# EAGLE design Arctos 65 V0 (EAGLE 9.6.2)
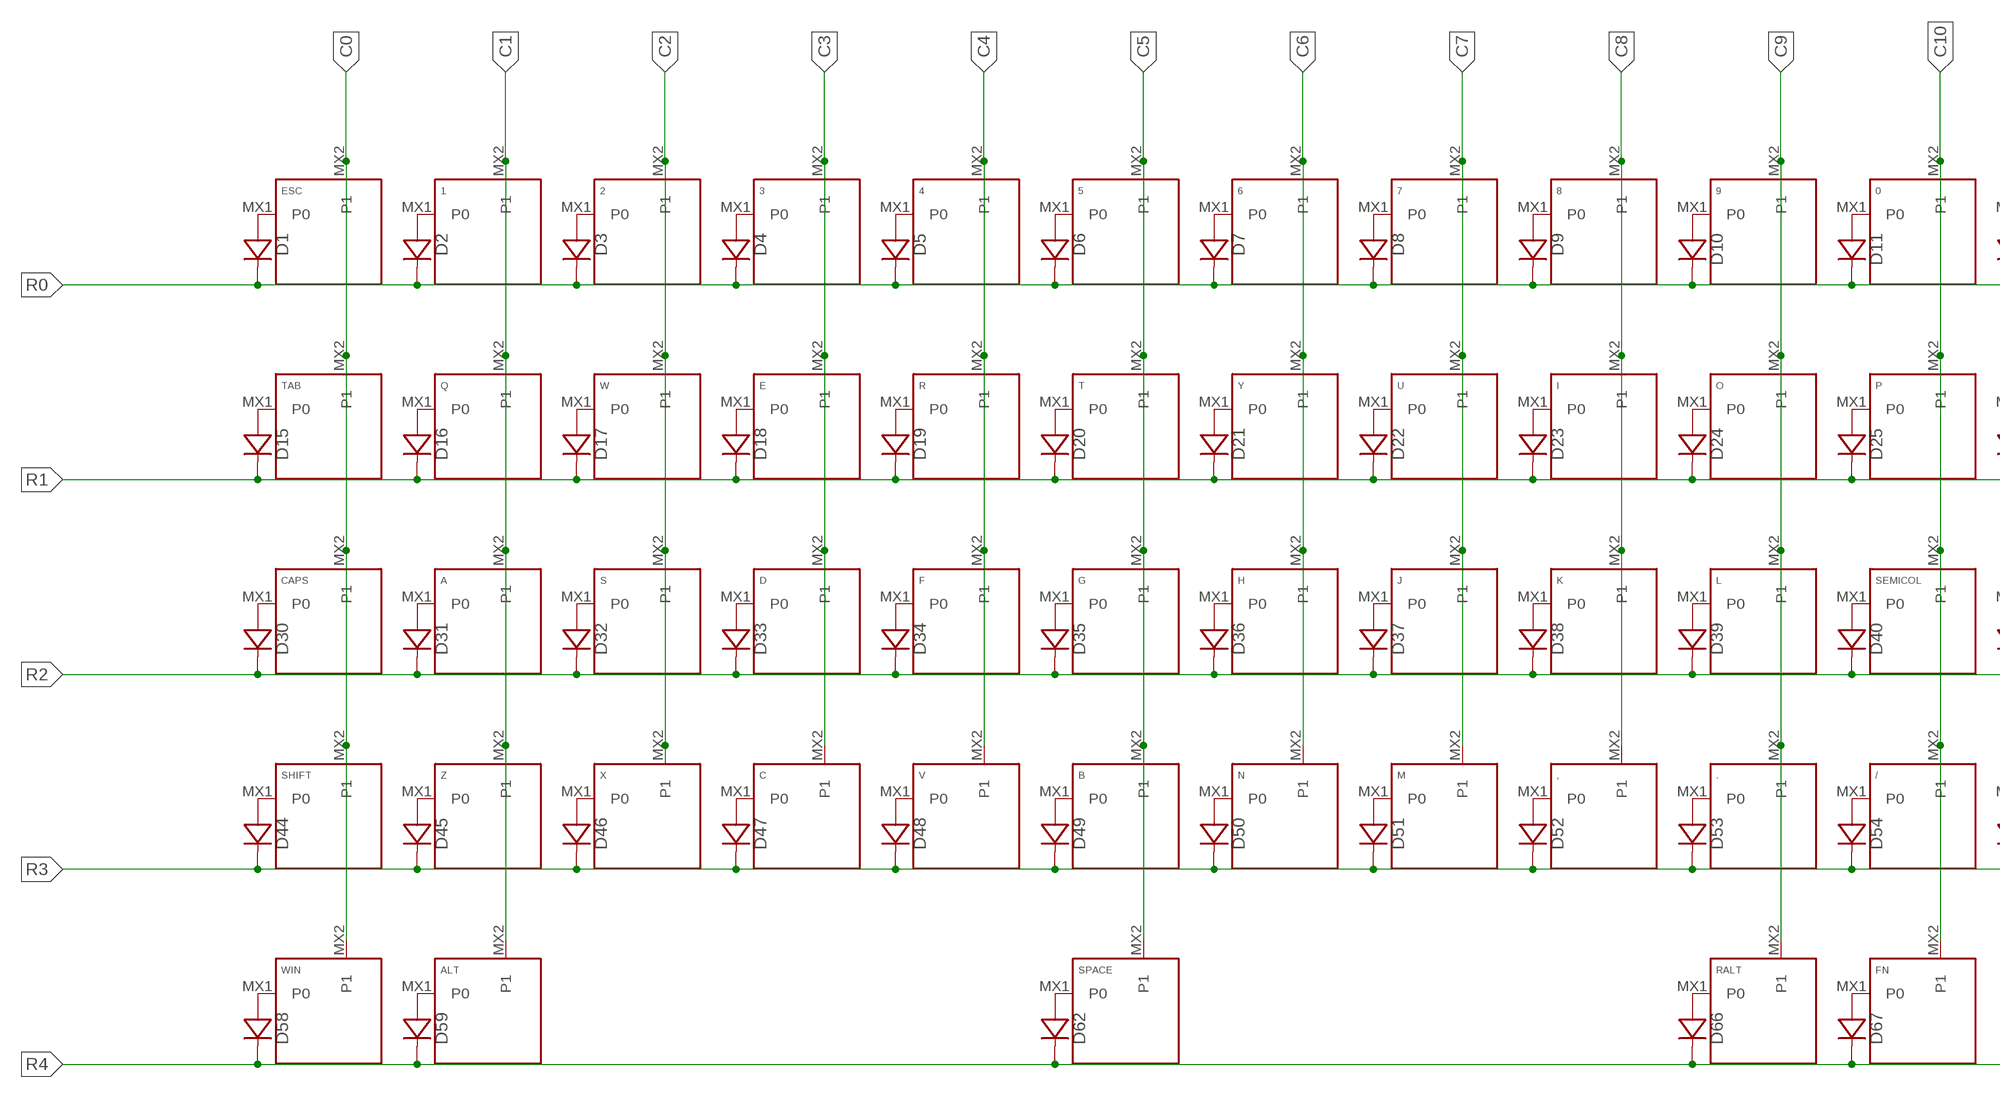
[diagram p0: schematic, sheet 1, part 1 of 2]
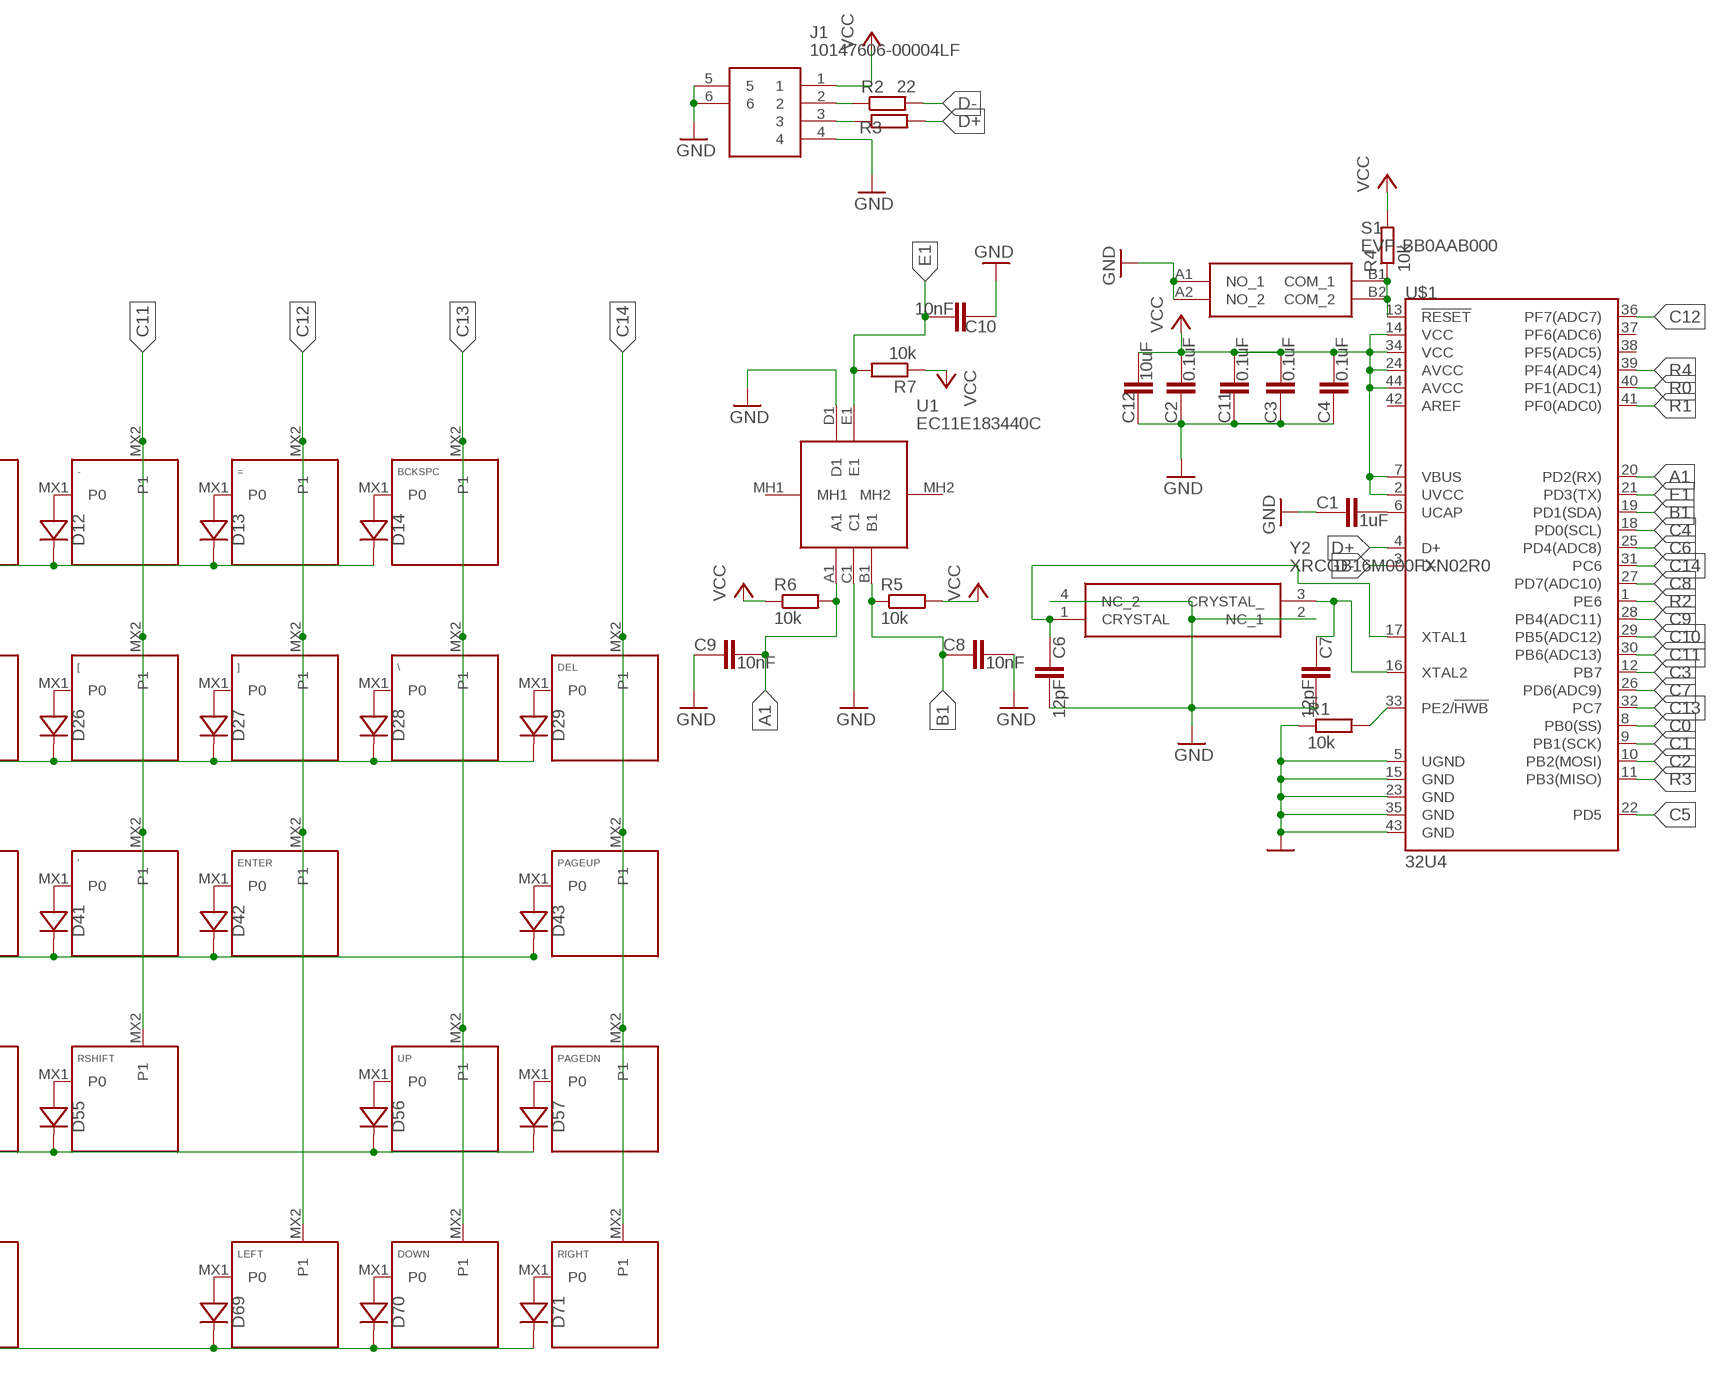
[diagram p1: schematic, sheet 1, part 2 of 2]

## Parts
0  KEYSWITCH-PLAIN-MXHSPCB-1U  [MXHSPCB-1U]
1  KEYSWITCH-PLAIN-MXHSPCB-1U  [MXHSPCB-1U]
2  KEYSWITCH-PLAIN-MXHSPCB-1U  [MXHSPCB-1U]
3  KEYSWITCH-PLAIN-MXHSPCB-1U  [MXHSPCB-1U]
4  KEYSWITCH-PLAIN-MXHSPCB-1U  [MXHSPCB-1U]
5  KEYSWITCH-PLAIN-MXHSPCB-1U  [MXHSPCB-1U]
6  KEYSWITCH-PLAIN-MXHSPCB-1U  [MXHSPCB-1U]
7  KEYSWITCH-PLAIN-MXHSPCB-1U  [MXHSPCB-1U]
8  KEYSWITCH-PLAIN-MXHSPCB-1U  [MXHSPCB-1U]
9  KEYSWITCH-PLAIN-MXHSPCB-1U  [MXHSPCB-1U]
'  KEYSWITCH-PLAIN-MXHSPCB-1U  [MXHSPCB-1U]
,  KEYSWITCH-PLAIN-MXHSPCB-1U  [MXHSPCB-1U]
-  KEYSWITCH-PLAIN-MXHSPCB-1U  [MXHSPCB-1U]
.  KEYSWITCH-PLAIN-MXHSPCB-1U  [MXHSPCB-1U]
/  KEYSWITCH-PLAIN-MXHSPCB-1U  [MXHSPCB-1U]
=  KEYSWITCH-PLAIN-MXHSPCB-1U  [MXHSPCB-1U]
[  KEYSWITCH-PLAIN-MXHSPCB-1U  [MXHSPCB-1U]
\  KEYSWITCH-PLAIN-MXHSPCB-1U  [MXHSPCB-1U]
]  KEYSWITCH-PLAIN-MXHSPCB-1U  [MXHSPCB-1U]
A  KEYSWITCH-PLAIN-MXHSPCB-1U  [MXHSPCB-1U]
ALT  KEYSWITCH-PLAIN-MXHSPCB-1U  [MXHSPCB-1U]
B  KEYSWITCH-PLAIN-MXHSPCB-1U  [MXHSPCB-1U]
BCKSPC  KEYSWITCH-PLAIN-MXHSPCB-2U  [MXHSPCB-2U]
C  KEYSWITCH-PLAIN-MXHSPCB-1U  [MXHSPCB-1U]
C1  1uF  CAPACITOR-0603  [C0603]
C2  0.1uF  CAPACITOR-0603  [C0603]
C3  0.1uF  CAPACITOR-0603  [C0603]
C4  0.1uF  CAPACITOR-0603  [C0603]
C6  12pF  CAPACITOR-0603  [C0603]
C7  12pF  CAPACITOR-0603  [C0603]
C8  10nF  CAPACITOR-0603  [C0603]
C9  10nF  CAPACITOR-0603  [C0603]
C10  10nF  CAPACITOR-0603  [C0603]
C11  0.1uF  CAPACITOR-0603  [C0603]
C12  10uF  CAPACITOR-0603  [C0603]
CAPS  KEYSWITCH-PLAIN-MXHSPCB-1U  [MXHSPCB-1U]
D  KEYSWITCH-PLAIN-MXHSPCB-1U  [MXHSPCB-1U]
D1  DIODE-SOD-123  [SOD-123]
D2  DIODE-SOD-123  [SOD-123]
D3  DIODE-SOD-123  [SOD-123]
D4  DIODE-SOD-123  [SOD-123]
D5  DIODE-SOD-123  [SOD-123]
D6  DIODE-SOD-123  [SOD-123]
D7  DIODE-SOD-123  [SOD-123]
D8  DIODE-SOD-123  [SOD-123]
D9  DIODE-SOD-123  [SOD-123]
D10  DIODE-SOD-123  [SOD-123]
D11  DIODE-SOD-123  [SOD-123]
D12  DIODE-SOD-123  [SOD-123]
D13  DIODE-SOD-123  [SOD-123]
D14  DIODE-SOD-123  [SOD-123]
D15  DIODE-SOD-123  [SOD-123]
D16  DIODE-SOD-123  [SOD-123]
D17  DIODE-SOD-123  [SOD-123]
D18  DIODE-SOD-123  [SOD-123]
D19  DIODE-SOD-123  [SOD-123]
D20  DIODE-SOD-123  [SOD-123]
D21  DIODE-SOD-123  [SOD-123]
D22  DIODE-SOD-123  [SOD-123]
D23  DIODE-SOD-123  [SOD-123]
D24  DIODE-SOD-123  [SOD-123]
D25  DIODE-SOD-123  [SOD-123]
D26  DIODE-SOD-123  [SOD-123]
D27  DIODE-SOD-123  [SOD-123]
D28  DIODE-SOD-123  [SOD-123]
D29  DIODE-SOD-123  [SOD-123]
D30  DIODE-SOD-123  [SOD-123]
D31  DIODE-SOD-123  [SOD-123]
D32  DIODE-SOD-123  [SOD-123]
D33  DIODE-SOD-123  [SOD-123]
D34  DIODE-SOD-123  [SOD-123]
D35  DIODE-SOD-123  [SOD-123]
D36  DIODE-SOD-123  [SOD-123]
D37  DIODE-SOD-123  [SOD-123]
D38  DIODE-SOD-123  [SOD-123]
D39  DIODE-SOD-123  [SOD-123]
D40  DIODE-SOD-123  [SOD-123]
D41  DIODE-SOD-123  [SOD-123]
D42  DIODE-SOD-123  [SOD-123]
D43  DIODE-SOD-123  [SOD-123]
D44  DIODE-SOD-123  [SOD-123]
D45  DIODE-SOD-123  [SOD-123]
D46  DIODE-SOD-123  [SOD-123]
D47  DIODE-SOD-123  [SOD-123]
D48  DIODE-SOD-123  [SOD-123]
D49  DIODE-SOD-123  [SOD-123]
D50  DIODE-SOD-123  [SOD-123]
D51  DIODE-SOD-123  [SOD-123]
D52  DIODE-SOD-123  [SOD-123]
D53  DIODE-SOD-123  [SOD-123]
D54  DIODE-SOD-123  [SOD-123]
D55  DIODE-SOD-123  [SOD-123]
D56  DIODE-SOD-123  [SOD-123]
D57  DIODE-SOD-123  [SOD-123]
D58  DIODE-SOD-123  [SOD-123]
D59  DIODE-SOD-123  [SOD-123]
D62  DIODE-SOD-123  [SOD-123]
D66  DIODE-SOD-123  [SOD-123]
D67  DIODE-SOD-123  [SOD-123]
D69  DIODE-SOD-123  [SOD-123]
D70  DIODE-SOD-123  [SOD-123]
D71  DIODE-SOD-123  [SOD-123]
DEL  KEYSWITCH-PLAIN-MXHSPCB-1U  [MXHSPCB-1U]
DOWN  KEYSWITCH-PLAIN-MXHSPCB-1U  [MXHSPCB-1U]
E  KEYSWITCH-PLAIN-MXHSPCB-1U  [MXHSPCB-1U]
ENTER  KEYSWITCH-PLAIN-MXHSPCB-2U  [MXHSPCB-2U]
ESC  KEYSWITCH-PLAIN-MXHSPCB-1U  [MXHSPCB-1U]
F  KEYSWITCH-PLAIN-MXHSPCB-1U  [MXHSPCB-1U]
FN  KEYSWITCH-PLAIN-MXHSPCB-1U  [MXHSPCB-1U]
G  KEYSWITCH-PLAIN-MXHSPCB-1U  [MXHSPCB-1U]
H  KEYSWITCH-PLAIN-MXHSPCB-1U  [MXHSPCB-1U]
I  KEYSWITCH-PLAIN-MXHSPCB-1U  [MXHSPCB-1U]
J  KEYSWITCH-PLAIN-MXHSPCB-1U  [MXHSPCB-1U]
J1  10147606-00004LF  [1014760600004LF]
K  KEYSWITCH-PLAIN-MXHSPCB-1U  [MXHSPCB-1U]
L  KEYSWITCH-PLAIN-MXHSPCB-1U  [MXHSPCB-1U]
LEFT  KEYSWITCH-PLAIN-MXHSPCB-1U  [MXHSPCB-1U]
M  KEYSWITCH-PLAIN-MXHSPCB-1U  [MXHSPCB-1U]
N  KEYSWITCH-PLAIN-MXHSPCB-1U  [MXHSPCB-1U]
O  KEYSWITCH-PLAIN-MXHSPCB-1U  [MXHSPCB-1U]
P  KEYSWITCH-PLAIN-MXHSPCB-1U  [MXHSPCB-1U]
PAGEDN  KEYSWITCH-PLAIN-MXHSPCB-1U  [MXHSPCB-1U]
PAGEUP  KEYSWITCH-PLAIN-MXHSPCB-1U  [MXHSPCB-1U]
Q  KEYSWITCH-PLAIN-MXHSPCB-1U  [MXHSPCB-1U]
R  KEYSWITCH-PLAIN-MXHSPCB-1U  [MXHSPCB-1U]
R1  10k  RESISTOR-0603  [R0603]
R2  22  RESISTOR-0603  [R0603]
R3  22  RESISTOR-0603  [R0603]
R4  10k  RESISTOR-0603  [R0603]
R5  10k  RESISTOR-0603  [R0603]
R6  10k  RESISTOR-0603  [R0603]
R7  10k  RESISTOR-0603  [R0603]
RALT  KEYSWITCH-PLAIN-MXHSPCB-1U  [MXHSPCB-1U]
RIGHT  KEYSWITCH-PLAIN-MXHSPCB-1U  [MXHSPCB-1U]
RSHIFT  KEYSWITCH-PLAIN-MXHSPCB-1U  [MXHSPCB-1U]
S  KEYSWITCH-PLAIN-MXHSPCB-1U  [MXHSPCB-1U]
S1  EVP-BB0AAB000  [EVPBB0AAB000]
SEMICOL  KEYSWITCH-PLAIN-MXHSPCB-1U  [MXHSPCB-1U]
SHIFT  KEYSWITCH-PLAIN-MXHSPCB-2U  [MXHSPCB-2U]
SPACE  KEYSWITCH-PLAIN-MXHSPCB-7U-FLIPPED  [MXHSPCB-7U-FLIPPED]
T  KEYSWITCH-PLAIN-MXHSPCB-1U  [MXHSPCB-1U]
TAB  KEYSWITCH-PLAIN-MXHSPCB-1U  [MXHSPCB-1U]
U  KEYSWITCH-PLAIN-MXHSPCB-1U  [MXHSPCB-1U]
U1  EC11E183440C  [EC11E183440C]
U$1  32U4  ATMEGA32U4TQFP-44  [TQFP44]
UP  KEYSWITCH-PLAIN-MXHSPCB-1U  [MXHSPCB-1U]
V  KEYSWITCH-PLAIN-MXHSPCB-1U  [MXHSPCB-1U]
W  KEYSWITCH-PLAIN-MXHSPCB-1U  [MXHSPCB-1U]
WIN  KEYSWITCH-PLAIN-MXHSPCB-1U  [MXHSPCB-1U]
X  KEYSWITCH-PLAIN-MXHSPCB-1U  [MXHSPCB-1U]
Y  KEYSWITCH-PLAIN-MXHSPCB-1U  [MXHSPCB-1U]
Y2  XRCGB16M000FXN02R0  [XRCGB16M000FXN02R0]
Z  KEYSWITCH-PLAIN-MXHSPCB-1U  [MXHSPCB-1U]

## Nets
A1: C9.2 R6.2 U1.A1 U$1.20(PD2(RX))
B1: C8.1 R5.1 U1.B1 U$1.19(PD1(SDA))
C0: CAPS.MX2(P1) ESC.MX2(P1) SHIFT.MX2(P1) TAB.MX2(P1) U$1.8(PB0(SS)) WIN.MX2(P1)
C1: 1.MX2(P1) A.MX2(P1) ALT.MX2(P1) Q.MX2(P1) U$1.9(PB1(SCK)) Z.MX2(P1)
C2: 2.MX2(P1) S.MX2(P1) U$1.10(PB2(MOSI)) W.MX2(P1) X.MX2(P1)
C3: 3.MX2(P1) C.MX2(P1) D.MX2(P1) E.MX2(P1) U$1.12(PB7)
C4: 4.MX2(P1) F.MX2(P1) R.MX2(P1) U$1.18(PD0(SCL)) V.MX2(P1)
C5: 5.MX2(P1) B.MX2(P1) G.MX2(P1) SPACE.MX2(P1) T.MX2(P1) U$1.22(PD5)
C6: 6.MX2(P1) H.MX2(P1) N.MX2(P1) U$1.25(PD4(ADC8)) Y.MX2(P1)
C7: 7.MX2(P1) J.MX2(P1) M.MX2(P1) U$1.26(PD6(ADC9)) U.MX2(P1)
C8: 8.MX2(P1) ,.MX2(P1) I.MX2(P1) K.MX2(P1) U$1.27(PD7(ADC10))
C9: 9.MX2(P1) ..MX2(P1) L.MX2(P1) O.MX2(P1) RALT.MX2(P1) U$1.28(PB4(ADC11))
C10: 0.MX2(P1) /.MX2(P1) FN.MX2(P1) P.MX2(P1) SEMICOL.MX2(P1) U$1.29(PB5(ADC12))
C11: '.MX2(P1) -.MX2(P1) [.MX2(P1) RSHIFT.MX2(P1) U$1.30(PB6(ADC13))
C12: =.MX2(P1) ].MX2(P1) ENTER.MX2(P1) LEFT.MX2(P1) U$1.36(PF7(ADC7))
C13: \.MX2(P1) BCKSPC.MX2(P1) DOWN.MX2(P1) U$1.32(PC7) UP.MX2(P1)
C14: DEL.MX2(P1) PAGEDN.MX2(P1) PAGEUP.MX2(P1) RIGHT.MX2(P1) U$1.31(PC6)
D+: R3.2 U$1.4(D+)
D-: R2.2 U$1.3(D-)
E1: C10.2 R7.2 U1.E1 U$1.21(PD3(TX))
GND: C1.1 C2.1 C3.1 C4.1 C6.2 C7.2 C8.2 C9.1 C10.1 C11.1 C12.1 J1.4 J1.5 J1.6 R1.1 S1.A1(NO_1) S1.A2(NO_2) U1.C1 U1.D1 U$1.5(UGND) U$1.15(GND) U$1.23(GND) U$1.35(GND) U$1.43(GND) Y2.2(NC_1) Y2.4(NC_2)
N$1: 4.MX1(P0) D5.A
N$2: 5.MX1(P0) D6.A
N$3: 6.MX1(P0) D7.A
N$4: 7.MX1(P0) D8.A
N$5: 8.MX1(P0) D9.A
N$6: 9.MX1(P0) D10.A
N$7: 0.MX1(P0) D11.A
N$8: -.MX1(P0) D12.A
N$9: =.MX1(P0) D13.A
N$10: BCKSPC.MX1(P0) D14.A
N$11: D15.A TAB.MX1(P0)
N$12: D16.A Q.MX1(P0)
N$13: D17.A W.MX1(P0)
N$14: D18.A E.MX1(P0)
N$15: D19.A R.MX1(P0)
N$16: D20.A T.MX1(P0)
N$17: D21.A Y.MX1(P0)
N$18: D22.A U.MX1(P0)
N$19: D23.A I.MX1(P0)
N$20: D24.A O.MX1(P0)
N$21: D25.A P.MX1(P0)
N$22: [.MX1(P0) D26.A
N$23: ].MX1(P0) D27.A
N$24: \.MX1(P0) D28.A
N$25: D29.A DEL.MX1(P0)
N$26: CAPS.MX1(P0) D30.A
N$27: A.MX1(P0) D31.A
N$28: D32.A S.MX1(P0)
N$29: D33.A D.MX1(P0)
N$30: D34.A F.MX1(P0)
N$31: D35.A G.MX1(P0)
N$32: D36.A H.MX1(P0)
N$33: D37.A J.MX1(P0)
N$34: D38.A K.MX1(P0)
N$35: D39.A L.MX1(P0)
N$36: D40.A SEMICOL.MX1(P0)
N$37: '.MX1(P0) D41.A
N$38: D42.A ENTER.MX1(P0)
N$39: D43.A PAGEUP.MX1(P0)
N$40: D45.A Z.MX1(P0)
N$41: D46.A X.MX1(P0)
N$42: C.MX1(P0) D47.A
N$43: D48.A V.MX1(P0)
N$44: D1.A ESC.MX1(P0)
N$45: B.MX1(P0) D49.A
N$46: D50.A N.MX1(P0)
N$47: 1.MX1(P0) D2.A
N$48: D51.A M.MX1(P0)
N$49: ,.MX1(P0) D52.A
N$50: ..MX1(P0) D53.A
N$51: /.MX1(P0) D54.A
N$52: D55.A RSHIFT.MX1(P0)
N$53: 2.MX1(P0) D3.A
N$54: 3.MX1(P0) D4.A
N$55: D56.A UP.MX1(P0)
N$56: D44.A SHIFT.MX1(P0)
N$57: D57.A PAGEDN.MX1(P0)
N$58: D58.A WIN.MX1(P0)
N$59: ALT.MX1(P0) D59.A
N$60: D66.A RALT.MX1(P0)
N$61: D67.A FN.MX1(P0)
N$62: D69.A LEFT.MX1(P0)
N$63: D70.A DOWN.MX1(P0)
N$64: D71.A RIGHT.MX1(P0)
N$65: D62.A SPACE.MX1(P0)
N$66: R4.1 S1.B1(COM_1) S1.B2(COM_2) U$1.13(!RESET)
N$67: R1.2 U$1.33(PE2/!HWB)
N$68: J1.2 R2.1
N$69: J1.3 R3.1
N$70: C1.2 U$1.6(UCAP)
N$71: C6.1 U$1.17(XTAL1) Y2.1(CRYSTAL)
N$73: C7.1 U$1.16(XTAL2) Y2.3(CRYSTAL_)
R0: D1.C D2.C D3.C D4.C D5.C D6.C D7.C D8.C D9.C D10.C D11.C D12.C D13.C D14.C U$1.40(PF1(ADC1))
R1: D15.C D16.C D17.C D18.C D19.C D20.C D21.C D22.C D23.C D24.C D25.C D26.C D27.C D28.C D29.C U$1.41(PF0(ADC0))
R2: D30.C D31.C D32.C D33.C D34.C D35.C D36.C D37.C D38.C D39.C D40.C D41.C D42.C D43.C U$1.1(PE6)
R3: D44.C D45.C D46.C D47.C D48.C D49.C D50.C D51.C D52.C D53.C D54.C D55.C D56.C D57.C U$1.11(PB3(MISO))
R4: D58.C D59.C D62.C D66.C D67.C D69.C D70.C D71.C U$1.39(PF4(ADC4))
VCC: C2.2 C3.2 C4.2 C11.2 C12.2 J1.1 R4.2 R5.2 R6.1 R7.1 U$1.2(UVCC) U$1.7(VBUS) U$1.14(VCC) U$1.24(AVCC) U$1.34(VCC) U$1.44(AVCC)
Unconnected: U1.MH1 U1.MH2 U$1.37(PF6(ADC6)) U$1.38(PF5(ADC5)) U$1.42(AREF)

## Library data of the parts
0 1-9 ' , - . / = [ \ ] A ALT B BCKSPC C CAPS D DEL DOWN E ENTER ESC F FN G H I J K L LEFT M N O P PAGEDN PAGEUP Q R RALT RIGHT RSHIFT S SEMICOL SHIFT SPACE T TAB U UP V W WIN X Y Z = Keyboard:KEYSWITCH-PLAIN
C1-C4 C6-C12 = Components:CAPACITOR
D1-D59 D62 D66 D67 D69-D71 = Components:DIODE: Standard 1N4148 diode
J1 = SamacSys_Parts:10147606-00004LF: Headers & Wire Housings R/A SMT Header Source: Datasheet <https://cdn.amphenol-icc.com/media/wysiwyg/files/drawing/10147606.pdf>; DESCRIPTION: Headers & Wire Housings R/A SMT Header; HEIGHT: 3.1mm; MANUFACTURER_NAME: Amphenol; MANUFACTURER_PART_NUMBER: 10147606-00004LF; MOUSER_PART_NUMBER: 649-10147606-00004LF; MOUSER_PRICE-STOCK: https://www.mouser.co.uk/ProductDetail/Amphenol-FCI/10147606-00004LF?qs=w%2Fv1CP2dgqrztttIAfWk1w%3D%3D
R1-R7 = Components:RESISTOR
S1 = SamacSys_Parts:EVP-BB0AAB000: Tactile Switches 2.6x1.6x0.5mm 0.7N 0.08mm Travel Source: Datasheet <https://componentsearchengine.com/Datasheets/1/EVP-BB0AAB000.pdf>; DESCRIPTION: Tactile Switches 2.6x1.6x0.5mm 0.7N 0.08mm Travel; HEIGHT: 0.6mm; MANUFACTURER_NAME: Panasonic; MANUFACTURER_PART_NUMBER: EVP-BB0AAB000; MOUSER_PART_NUMBER: 667-EVP-BB0AAB000; MOUSER_PRICE-STOCK: https://www.mouser.co.uk/ProductDetail/Panasonic/EVP-BB0AAB000?qs=PzGy0jfpSMt797eGA9Hkvg%3D%3D
U1 = SamacSys_Parts:EC11E183440C: Alps 18 Pulse Incremental Mechanical Rotary Encoder with a 6 mm Flat Shaft (Not Indexed), Through Hole Source: Datasheet <https://www.alps.com/prod/info/E/HTML/Encoder/Incremental/EC11/EC11E183440C.html>; ARROW_PART_NUMBER: EC11E183440C; DESCRIPTION: Alps 18 Pulse Incremental Mechanical Rotary Encoder with a 6 mm Flat Shaft (Not Indexed), Through Hole; HEIGHT: 24.5mm; MANUFACTURER_NAME: ALPS; MANUFACTURER_PART_NUMBER: EC11E183440C; MOUSER_PART_NUMBER: 688-EC11E183440C; MOUSER_PRICE-STOCK: https://www.mouser.co.uk/ProductDetail/ALPS/EC11E183440C?qs=YMSFtX0bdJC6PoDF7K4k%252Bg%3D%3D
U$1 = SparkFun-IC-Microcontroller:ATMEGA32U4: Atmel MCU, 32KByte Atmel 44-pin 8-bit Microcontroller with 32KBytes of ISP Flash and USB Controller Datasheet <http://cdn.sparkfun.com/datasheets/Dev/Arduino/Boards/ATMega32U4.pdf> SparkFun Products LilyPad Arduino USB - ATmega32U4 Board <https://www.sparkfun.com/products/12049> (DEV-12049) Pro Micro - 5V/16MHz <https://www.sparkfun.com/products/12640> (DEV-12640) Pro Micro - 3.3V/8MHz <https://www.sparkfun.com/products/12587> (DEV-12587) Fio v3 - ATmega32U4 <https://www.sparkfun.com/products/11520> (DEV-11520) Qduino Mini <https://www.sparkfun.com/products/13614> (DEV-13614) Makey Makey - Standard Kit <https://www.sparkfun.com/products/11511> (WIG-11511) Makey Makey Deluxe Kit <https://www.sparkfun.com/products/11519> (WIG-11519); PROD_ID: IC-11161
Y2 = SamacSys_Parts:XRCGB16M000FXN02R0: 2.0x1.6x0.65mm 16MHz Crystal +/-40ppm Initial tolerance (Total) Source: Datasheet <https://www.arrow.com/en/products/xrcgb16m000fxn02r0/murata-power-solutions>; DESCRIPTION: 2.0x1.6x0.65mm 16MHz Crystal +/-40ppm Initial tolerance (Total); HEIGHT: 0.7mm; MANUFACTURER_NAME: Murata Electronics; MANUFACTURER_PART_NUMBER: XRCGB16M000FXN02R0; MOUSER_PART_NUMBER: 81-XRCGB16M000FXN02R; MOUSER_PRICE-STOCK: https://www.mouser.co.uk/ProductDetail/Murata-Electronics/XRCGB16M000FXN02R0?qs=rrS6PyfT74cg1tYp2g5aug%3D%3D

## Board
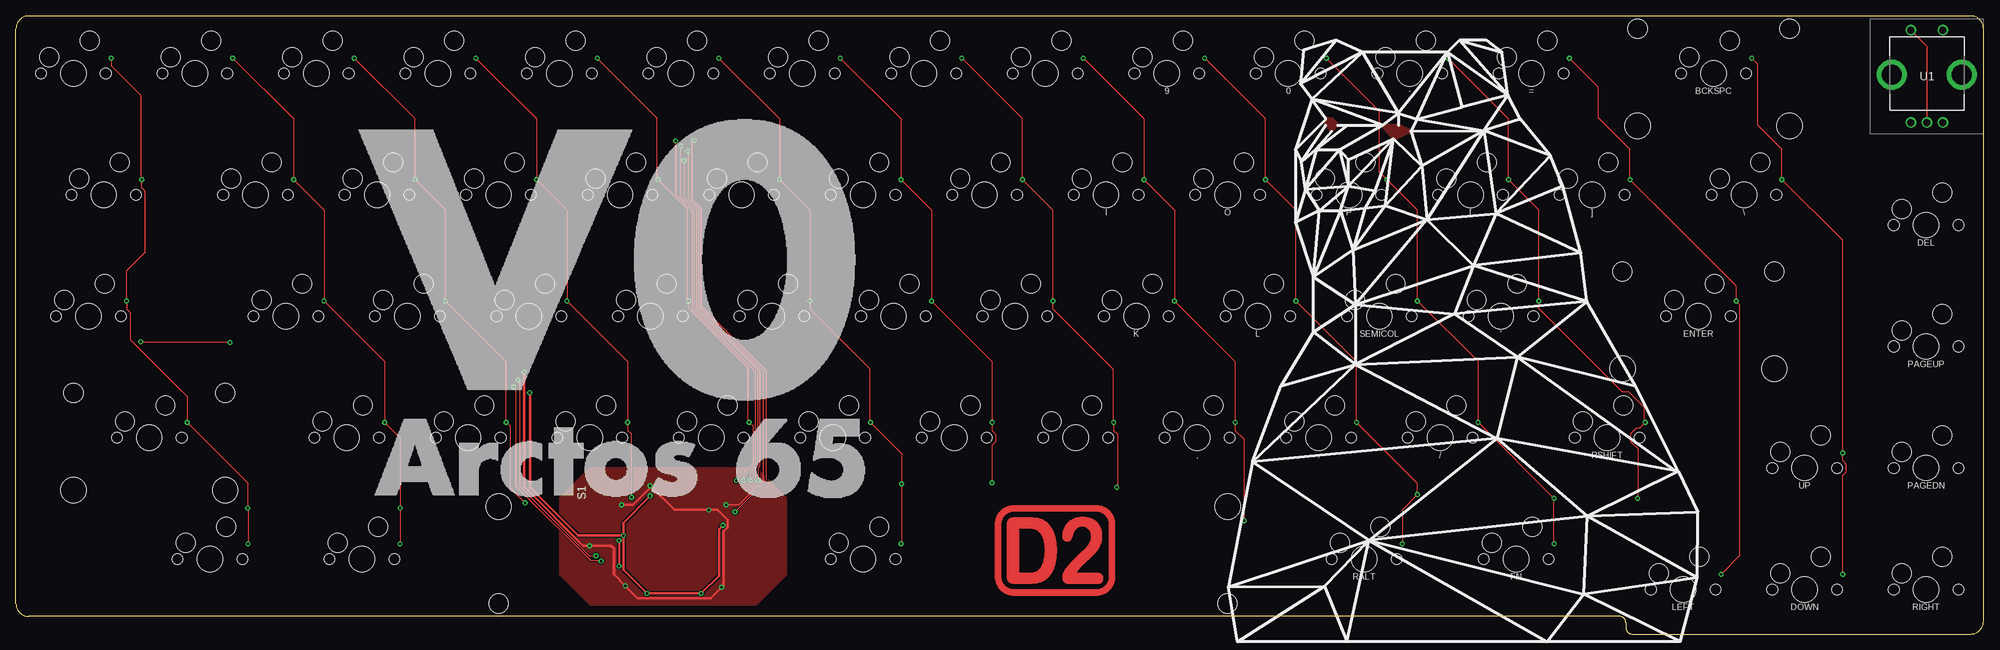
[diagram p2: board, top side]
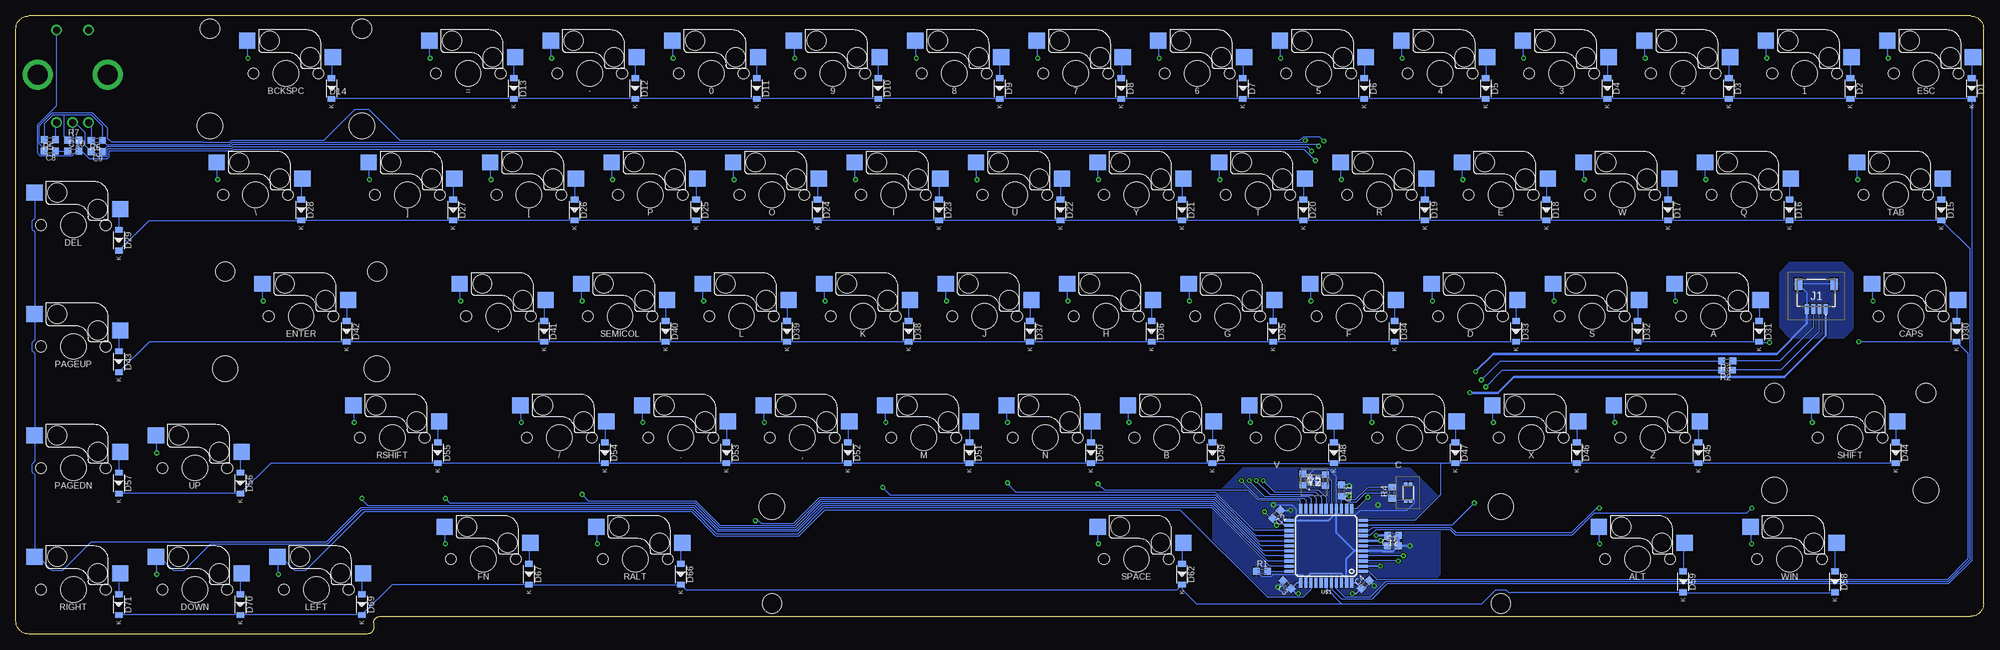
[diagram p3: board, bottom side, seen from below]

Size 308.51 x 96.96 mm. Coordinates in mm from the lower left corner, seen from the top.
Outline: 2,96.96 arc90 0,94.96
Outline: 308.51,94.96 arc90 306.51,96.96
Outline: 306.51,0 arc90 308.51,2
Outline: 0,4.76 arc90 2,2.76
Outline: 252.41,1.76 arc90 251.41,2.76
Outline: 252.41,1 arc90 253.41,0
Outline: 0,4.76 0,94.96
Outline: 308.51,2 308.51,94.96
Outline: 2,96.96 306.51,96.96
Outline: 2,96.96 arc90 0,94.96
Outline: 308.51,94.96 arc90 306.51,96.96
Outline: 251.41,2.76 2,2.76
Outline: 252.41,1.76 252.41,1
Outline: 306.51,0 arc90 308.51,2
Outline: 0,4.76 arc90 2,2.76
Outline: 252.41,1.76 arc90 251.41,2.76
Outline: 252.41,1 arc90 253.41,0
Outline: 253.41,0 306.51,0
Copper layers (1*16): Top 0.035mm / dielectric 1.5mm / Bottom 0.035mm
Design rules "default *": minimum track width 6mil, minimum drill 0.35mm, track to track 6mil, track to pad 6mil, pad to pad 6mil, via to via 6mil, smd to smd 6mil, copper to edge 20mil, drill to drill 6mil, minimum pad ring 10mil, minimum via ring 8mil, stop-mask expansion 4mil, vias tented up to drill 0mil, thermal gap 10mil

### Footprints (pad centres in the part's own frame; a part is rotated, then mirrored left to right if it is on the bottom)
MXHSPCB-1U = smd 2.55 x 2.5: MX1 7.36,2.54; MX2 -6.09,5.08 | hole 4: 0,0 | hole 1.7: 5.08,0; -5.08,0 | hole 3: 3.81,2.54; -2.54,5.08
MXHSPCB-2U = smd 2.55 x 2.5: MX1 7.36,2.54; MX2 -6.09,5.08 | hole 4: 0,0; -11.9,-8.24; 11.9,-8.24 | hole 1.7: 5.08,0; -5.08,0 | hole 3: 3.81,2.54; -2.54,5.08 | hole 3.05: -11.9,7; 11.9,7
C0603 = smd 1.05 x 1.08: 1 -0.875,0; 2 0.875,0
SOD-123 = smd 0.91 x 1.22: A -1.635,0; C 1.635,0
1014760600004LF = smd 0.6 x 1.55: 1 -1.5,2; 2 -0.5,2; 3 0.5,2; 4 1.5,2 | smd 1.2 x 1.8: 5 -2.8,-1.875; 6 2.8,-1.875
R0603 = smd 1.05 x 1.08: 1 -0.875,0; 2 0.875,0
EVPBB0AAB000 = smd 0.55 x 0.55: A1 -1.325,0.375; A2 -1.325,-0.375; B1 1.325,0.375; B2 1.325,-0.375
MXHSPCB-7U-FLIPPED = smd 2.55 x 2.5: MX1 7.36,2.54; MX2 -6.09,5.08 | hole 4: 0,0; -57.15,8.24; 57.15,8.24 | hole 1.7: 5.08,0; -5.08,0 | hole 3: 3.81,2.54; -2.54,5.08 | hole 3.05: -57.15,-7; 57.15,-7
EC11E183440C = drill 1.1 pad 1.65: A1 0,0; B1 5,0; C1 2.5,0; D1 0,14.5; E1 5,14.5 | drill 3.139 pad 4.708: MH1 -3,7.5; MH2 8,7.5
TQFP44 = smd 1.5 x 0.5: 1 -5.8,4; 2 -5.8,3.2; 3 -5.8,2.4; 4 -5.8,1.6; 5 -5.8,0.8; 6 -5.8,0; 7 -5.8,-0.8; 8 -5.8,-1.6; 9 -5.8,-2.4; 10 -5.8,-3.2; 11 -5.8,-4; 23 5.8,-4; 24 5.8,-3.2; 25 5.8,-2.4; 26 5.8,-1.6; 27 5.8,-0.8; 28 5.8,0; 29 5.8,0.8; 30 5.8,1.6; 31 5.8,2.4; 32 5.8,3.2; 33 5.8,4 | smd 0.5 x 1.5: 12 -4,-5.8; 13 -3.2,-5.8; 14 -2.4,-5.8; 15 -1.6,-5.8; 16 -0.8,-5.8; 17 0,-5.8; 18 0.8,-5.8; 19 1.6,-5.8; 20 2.4,-5.8; 21 3.2,-5.8; 22 4,-5.8; 34 4,5.8; 35 3.2,5.8; 36 2.4,5.8; 37 1.6,5.8; 38 0.8,5.8; 39 0,5.8; 40 -0.8,5.8; 41 -1.6,5.8; 42 -2.4,5.8; 43 -3.2,5.8; 44 -4,5.8
XRCGB16M000FXN02R0 = smd 0.75 x 0.7: 1 -0.675,-0.45; 2 0.675,-0.45; 3 0.675,0.45; 4 -0.675,0.45

### Placement (x,y rotation side)
0  199.5,87.96 0 bottom
1  28.05,87.96 0 bottom
2  47.1,87.96 0 bottom
3  66.15,87.96 0 bottom
4  85.2,87.96 0 bottom
5  104.25,87.96 0 bottom
6  123.3,87.96 0 bottom
7  142.35,87.96 0 bottom
8  161.4,87.96 0 bottom
9  180.45,87.96 0 bottom
'  232.84,49.86 0 bottom
,  185.21,30.81 0 bottom
-  218.55,87.96 0 bottom
.  204.26,30.81 0 bottom
/  223.31,30.81 0 bottom
=  237.6,87.96 0 bottom
[  228.07,68.91 0 bottom
\  270.94,68.91 0 bottom
]  247.12,68.91 0 bottom
A  42.34,49.86 0 bottom
ALT  54.24,11.76 0 bottom
B  128.06,30.81 0 bottom
BCKSPC  266.18,87.96 0 bottom
C  89.96,30.81 0 bottom
C1  92.61,13.85 180 bottom
C2  110.86,18.77 225 bottom
C3  109.23,7.74 315 bottom
C4  96.94,7.76 225 bottom
C6  106.73,24.25 90 bottom
C7  103.19,24.14 270 bottom
C8  303.19,75.76 0 bottom
C9  295.84,75.66 0 bottom
C10  299.51,75.74 0 bottom
C11  100.68,22.52 270 bottom
C12  92.58,15.46 180 bottom
CAPS  11.38,49.86 0 bottom
D  80.44,49.86 0 bottom
D1  1.86,85.58 270 bottom
D2  20.91,85.58 270 bottom
D3  39.96,85.58 270 bottom
D4  59.01,85.58 270 bottom
D5  78.06,85.58 270 bottom
D6  97.11,85.58 270 bottom
D7  116.16,85.58 270 bottom
D8  135.21,85.58 270 bottom
D9  154.26,85.58 270 bottom
D10  173.31,85.58 270 bottom
D11  192.36,85.58 270 bottom
D12  211.41,85.58 270 bottom
D13  230.46,85.58 270 bottom
D14  259.03,85.58 270 bottom
D15  6.62,66.53 270 bottom
D16  30.43,66.53 270 bottom
D17  49.48,66.53 270 bottom
D18  68.53,66.53 270 bottom
D19  87.58,66.53 270 bottom
D20  106.63,66.53 270 bottom
D21  125.68,66.53 270 bottom
D22  144.73,66.53 270 bottom
D23  163.78,66.53 270 bottom
D24  182.83,66.53 270 bottom
D25  201.88,66.53 270 bottom
D26  220.93,66.53 270 bottom
D27  239.98,66.53 270 bottom
D28  263.79,66.53 270 bottom
D29  292.37,61.77 270 bottom
D30  4.24,47.48 270 bottom
D31  35.19,47.48 270 bottom
D32  54.24,47.48 270 bottom
D33  73.29,47.48 270 bottom
D34  92.34,47.48 270 bottom
D35  111.39,47.48 270 bottom
D36  130.44,47.48 270 bottom
D37  149.49,47.48 270 bottom
D38  168.54,47.48 270 bottom
D39  187.59,47.48 270 bottom
D40  206.64,47.48 270 bottom
D41  225.69,47.48 270 bottom
D42  256.65,47.48 270 bottom
D43  292.37,42.72 270 bottom
D44  13.76,28.43 270 bottom
D45  44.72,28.43 270 bottom
D46  63.77,28.43 270 bottom
D47  82.82,28.43 270 bottom
D48  101.87,28.43 270 bottom
D49  120.92,28.43 270 bottom
D50  139.97,28.43 270 bottom
D51  159.02,28.43 270 bottom
D52  178.07,28.43 270 bottom
D53  197.12,28.43 270 bottom
D54  216.17,28.43 270 bottom
D55  242.36,28.43 270 bottom
D56  273.32,23.67 270 bottom
D57  292.37,23.67 270 bottom
D58  23.29,8.19 270 bottom
D59  47.1,8.19 270 bottom
D62  125.68,9.38 270 bottom
D66  204.26,9.38 270 bottom
D67  228.07,9.38 270 bottom
D69  254.27,4.62 270 bottom
D70  273.32,4.62 270 bottom
D71  292.37,4.62 270 bottom
DEL  299.51,64.15 0 bottom
DOWN  280.46,7 0 bottom
E  75.67,68.91 0 bottom
ENTER  263.79,49.86 0 bottom
ESC  9,87.96 0 bottom
F  99.49,49.86 0 bottom
FN  235.22,11.76 0 bottom
G  118.54,49.86 0 bottom
H  137.59,49.86 0 bottom
I  170.92,68.91 0 bottom
J  156.64,49.86 0 bottom
J1  26.22,53.01 180 bottom
K  175.69,49.86 0 bottom
L  194.74,49.86 0 bottom
LEFT  261.41,7 0 bottom
M  166.16,30.81 0 bottom
N  147.11,30.81 0 bottom
O  189.97,68.91 0 bottom
P  209.02,68.91 0 bottom
PAGEDN  299.51,26.05 0 bottom
PAGEUP  299.51,45.1 0 bottom
Q  37.58,68.91 0 bottom
R  94.73,68.91 0 bottom
R1  113.13,9.82 0 bottom
R2  40.21,41.39 180 bottom
R3  40.19,42.83 180 bottom
R4  92.77,22.16 90 bottom
R5  303.19,77.55 180 bottom
R6  295.84,77.45 180 bottom
R7  299.51,77.46 0 bottom
RALT  211.41,11.76 0 bottom
RIGHT  299.51,7 0 bottom
RSHIFT  249.51,30.81 0 bottom
S  61.39,49.86 0 bottom
S1  90.23,22.2 270 bottom
SEMICOL  213.79,49.86 0 bottom
SHIFT  20.91,30.81 0 bottom
SPACE  132.82,11.76 0 bottom
T  113.78,68.91 0 bottom
TAB  13.76,68.91 0 bottom
U  151.88,68.91 0 bottom
U1  297.13,80.22 0 top
U$1  103.07,13.83 180 bottom
UP  280.46,26.05 0 bottom
V  109.01,30.81 0 bottom
W  56.62,68.91 0 bottom
WIN  30.43,11.76 0 bottom
X  70.91,30.81 0 bottom
Y  132.82,68.91 0 bottom
Y2  104.97,24.13 0 bottom
Z  51.86,30.81 0 bottom

### Tracks (layer width: path | path; a pad name or v marks a point on that pad's centre or on a via)
A1  (via drill 0.35)
  Top 0.152: v115.15,24.05 115.15,25.37 116.26,26.48 116.26,41.33 106.37,51.22 106.37,66.5 104.16,68.71 104.16,76.46 v104.25,76.55
  Bottom 0.152: U1.A1 296.71,79.8 R6.2 294.96,75.7 C9.2 294.19,76.43 274.85,76.43 274.45,76.83 104.53,76.83 v104.25,76.55 | v115.15,24.05 112.72,21.62 105.82,21.62 105.45,21.25 105.45,19.66 U$1.20
B1  (via drill 0.35)
  Top 0.152: v114.05,24.05 114.05,24.72 115.88,26.55 115.88,41.17 106.05,50.99 106.05,66.38 103.45,68.99 v103.45,77.35
  Bottom 0.152: U1.B1 302.32,80.04 R5.1 304.07,75.8 C8.1 304.07,76.16 304.82,76.91 304.82,79.75 302.79,81.78 296.57,81.78 294.21,79.42 294.21,77.81 293.6,77.2 279.21,77.2 279.14,77.14 275,77.14 274.7,77.44 260.21,77.44 255.34,82.31 253.2,82.31 248.35,77.46 107.2,77.46 106.6,78.06 104.16,78.06 v103.45,77.35 | v114.05,24.05 111.92,21.92 105.25,21.92 104.65,21.32 104.65,19.66 U$1.19
C0  (via drill 0.35)
  Top 0.152: v14.95,90.34 14.95,89.12 19.58,84.49 19.58,71.43 v19.72,71.29 19.72,70.07 20.28,69.51 20.28,59.95 17.33,57.01 v17.33,52.24 17.33,51.02 17.89,50.46 17.89,46.2 26.86,37.24 v26.86,33.19 36.35,23.7 v36.35,19.75 36.38,19.72 v36.38,14.14
  Bottom 0.152: ESC.MX2 15.09,90.34 v14.95,90.34 | TAB.MX2 19.85,71.29 v19.72,71.29 | CAPS.MX2 17.47,52.24 v17.33,52.24 | SHIFT.MX2 27,33.19 v26.86,33.19 | WIN.MX2 36.52,14.28 v36.38,14.14 | v36.35,19.75 37.17,18.93 61.1,18.93 64.58,15.45 82.73,15.45 83.63,16.35 95.31,16.35 96.21,15.45 97.26,15.45 U$1.8
C1  (via drill 0.35)
  Top 0.152: v34,90.34 43.53,80.82 v43.53,71.29 48.29,66.53 v48.29,52.24 57.82,42.72 v57.82,33.19 60.25,30.76 v60.25,19.75 60.25,14.2 v60.2,14.14
  Bottom 0.152: 1.MX2 34.14,90.34 v34,90.34 | Q.MX2 43.67,71.29 v43.53,71.29 | A.MX2 48.43,52.24 v48.29,52.24 | Z.MX2 57.95,33.19 v57.82,33.19 | ALT.MX2 60.33,14.28 v60.2,14.14 | v60.25,19.75 60.71,19.75 64.61,15.85 82.65,15.85 83.49,16.69 95.86,16.69 96.31,16.23 U$1.9
C2  (via drill 0.35)
  Top 0.152: v53.05,90.34 62.58,80.82 v62.58,71.29 67.34,66.53 v67.34,52.24 76.87,42.72 v76.87,33.19 77.45,32.61 77.45,22.95 v79.85,20.55
  Bottom 0.152: 2.MX2 53.19,90.34 v53.05,90.34 | W.MX2 62.72,71.29 v62.58,71.29 | S.MX2 67.48,52.24 v67.34,52.24 | X.MX2 77,33.19 v76.87,33.19 | v79.85,20.55 83.35,17.05 97.26,17.05 U$1.10
C3  (via drill 0.35)
  Top 0.152: v72.1,90.34 81.63,80.82 v81.63,71.29 86.39,66.53 v86.39,52.24 95.92,42.72 v95.92,33.19 95.92,31.97 96.49,31.39 96.55,31.33 v96.55,21.45
  Bottom 0.152: 3.MX2 72.24,90.34 v72.1,90.34 | E.MX2 81.77,71.29 v81.63,71.29 | D.MX2 86.53,52.24 v86.39,52.24 | C.MX2 96.05,33.19 v95.92,33.19 | v96.55,21.45 98.37,19.63 U$1.12
C4  (via drill 0.35)
  Top 0.152: v91.15,90.34 100.54,80.96 100.54,71.43 v100.68,71.29 100.68,71.26 105.3,66.63 105.3,52.38 v105.44,52.24 105.44,51.11 114.83,41.72 114.83,33.33 v114.97,33.19 115.55,32.61 115.55,26.65 v112.95,24.05
  Bottom 0.152: 4.MX2 91.29,90.34 v91.15,90.34 | R.MX2 100.81,71.29 v100.68,71.29 | F.MX2 105.58,52.24 v105.44,52.24 | V.MX2 115.1,33.19 v114.97,33.19 | v112.95,24.05 111.13,22.23 104.65,22.23 103.85,21.43 103.85,19.66 U$1.18
C5  (via drill 0.35)
  Top 0.152: v110.2,90.34 119.73,80.82 v119.73,71.29 124.49,66.53 v124.49,52.24 124.49,51.02 133.88,41.63 133.88,33.33 v134.02,33.19 138.85,28.36 v138.85,23.55 138.85,14.22 v138.78,14.14
  Bottom 0.152: 5.MX2 110.34,90.34 v110.2,90.34 | T.MX2 119.86,71.29 v119.73,71.29 | G.MX2 124.63,52.24 v124.49,52.24 | B.MX2 134.15,33.19 v134.02,33.19 | SPACE.MX2 138.91,14.28 v138.78,14.14 | v138.85,23.55 137.87,22.57 115.31,22.57 113.74,21.01 107.27,21.01 107.07,20.82 U$1.22
C6  (via drill 0.35)
  Top 0.152: v129.25,90.34 138.78,80.82 v138.78,71.29 143.54,66.53 v143.54,52.24 153.07,42.72 v153.07,33.19 153.07,31.97 153.63,31.41 153.63,30.16 153.06,29.6 v153.06,23.71
  Bottom 0.152: 6.MX2 129.39,90.34 v129.25,90.34 | Y.MX2 138.91,71.29 v138.78,71.29 | H.MX2 143.68,52.24 v143.54,52.24 | N.MX2 153.2,33.19 v153.07,33.19 | U$1.25 114.44,16.23 120.43,22.23 151.67,22.23 153.06,23.62 v153.06,23.71
C7  (via drill 0.35)
  Top 0.152: v148.3,90.34 157.83,80.82 v157.83,71.29 162.59,66.53 v162.59,52.24 162.59,51.02 172.1,41.51 172.1,33.21 v172.12,33.19 172.12,31.97 172.68,31.41 172.68,23.08 v172.61,23.01
  Bottom 0.152: 7.MX2 148.44,90.34 v148.3,90.34 | U.MX2 157.96,71.29 v157.83,71.29 | J.MX2 162.73,52.24 v162.59,52.24 | M.MX2 172.25,33.19 v172.12,33.19 | v172.61,23.01 171.43,21.83 120.46,21.83 114.07,15.43 U$1.26
C8  (via drill 0.35)
  Top 0.152: v167.35,90.34 176.88,80.82 v176.88,71.29 181.64,66.53 v181.64,52.24 191.17,42.72 v191.17,33.19 191.17,31.97 192.56,30.57 192.56,17.92 v192.57,17.77
  Bottom 0.152: 8.MX2 167.49,90.34 v167.35,90.34 | I.MX2 177.01,71.29 v176.88,71.29 | K.MX2 181.78,52.24 v181.64,52.24 | ,.MX2 191.3,33.19 v191.17,33.19 | v192.57,17.77 192.04,17.77 191.63,17.37 186.6,17.37 182.53,21.44 120.5,21.44 113.7,14.63 U$1.27
C9  (via drill 0.35)
  Top 0.152: v186.4,90.34 195.93,80.82 v195.93,71.29 200.69,66.53 v200.69,52.24 210.22,42.72 v210.22,33.19 210.22,33.16 219.74,23.63 v219.74,21.88 217.36,19.5 v217.36,14.14
  Bottom 0.152: 9.MX2 186.54,90.34 v186.4,90.34 | O.MX2 196.06,71.29 v195.93,71.29 | L.MX2 200.83,52.24 v200.69,52.24 | ..MX2 210.35,33.19 v210.22,33.19 | RALT.MX2 217.5,14.14 v217.36,14.14 | v219.74,21.88 218.77,20.91 201.93,20.91 198.08,17.06 186.42,17.06 182.37,21.12 120.61,21.12 113.33,13.83 U$1.28
C10  (via drill 0.35)
  Top 0.152: v205.45,90.34 213.7,82.09 213.7,72.54 214.95,71.29 v214.98,71.29 219.74,66.53 v219.74,52.24 229.27,42.72 v229.27,33.19 v241.17,21.29 v241.17,14.14
  Bottom 0.152: 0.MX2 205.59,90.34 v205.45,90.34 | P.MX2 215.11,71.29 v214.98,71.29 | SEMICOL.MX2 219.88,52.24 v219.74,52.24 | /.MX2 229.4,33.19 v229.27,33.19 | FN.MX2 241.31,14.14 v241.17,14.14 | v241.17,21.29 240.48,20.59 202.05,20.59 198.21,16.76 186.3,16.76 182.24,20.81 120.74,20.81 112.96,13.03 U$1.29
C11  (via drill 0.35)
  Top 0.152: v224.5,90.34 234.03,80.82 v234.03,71.29 238.79,66.53 v238.79,52.24 238.79,51.07 251.88,37.98 252.91,37.98 255.32,35.56 255.32,33.33 v255.46,33.19 254.51,32.25 253.99,32.25 253.15,31.41 253.15,30.22 254.27,29.1 v254.27,21.29
  Bottom 0.152: -.MX2 224.64,90.34 v224.5,90.34 | [.MX2 234.16,71.29 v234.03,71.29 | '.MX2 238.93,52.24 v238.79,52.24 | RSHIFT.MX2 255.6,33.19 v255.46,33.19 | v254.27,21.29 254.27,21.09 253.38,20.2 202.09,20.2 198.34,16.45 186.15,16.45 182.09,20.51 120.86,20.51 112.59,12.23 U$1.30
C12  (via drill 0.35)
  Top 0.152: v243.55,90.34 248.12,85.78 248.12,81.03 253.08,76.07 v253.08,71.29 269.75,54.62 v269.75,52.24 269.75,52.21 270.31,51.65 270.31,12.32 v267.37,9.38
  Bottom 0.152: =.MX2 243.69,90.34 v243.55,90.34 | ].MX2 253.21,71.29 v253.08,71.29 | ENTER.MX2 269.88,52.24 v269.75,52.24 | v267.37,9.38 267.5,9.38 LEFT.MX2 266.9,12.08 264.82,10 263.09,10 253.85,19.23 202.6,19.23 198.79,15.42 185.74,15.42 181.66,19.5 125.97,19.5 112.21,5.74 106.76,5.74 105.47,7.03 U$1.36
C13  (via drill 0.35)
  Top 0.152: v272.13,90.34 273.11,89.36 273.11,79.84 276.89,76.06 v276.89,71.29 286.42,61.77 v286.42,28.43 286.42,27.2 286.98,26.64 286.98,25.46 286.42,24.89 v286.42,9.38
  Bottom 0.152: BCKSPC.MX2 272.26,90.34 v272.13,90.34 | \.MX2 277.03,71.29 v276.89,71.29 | UP.MX2 286.55,28.43 v286.42,28.43 | v286.42,9.38 286.55,9.38 DOWN.MX2 285.95,12.08 283.87,10 282.14,10 277.97,14.16 259.61,14.16 254.23,19.54 202.41,19.54 198.63,15.75 185.86,15.75 181.78,19.84 121.07,19.84 111.87,10.63 U$1.32
C14
  Bottom 0.152: DEL.MX2 305.6,65.17 306.03,64.74 306.03,63.56 305.6,63.13 PAGEUP.MX2 305.6,46.12 306.03,45.69 306.03,44.51 305.6,44.08 PAGEDN.MX2 305.6,27.07 306.03,26.64 306.03,25.46 305.6,25.03 RIGHT.MX2 305,12.08 302.92,10 301.19,10 296.72,14.47 259.8,14.47 254.37,19.9 202.28,19.9 198.53,16.15 185.99,16.15 181.94,20.2 121,20.2 112.23,11.43 U$1.31
D+  (via drill 0.35)
  Top 0.152: v90.95,12.25 89.86,12.25 78.95,23.16 78.95,39.65 v78.75,39.85
  Bottom 0.152: v90.95,12.25 97.26,12.25 U$1.4 | v78.75,39.85 75.79,42.81 41.09,42.81 R3.2
D-  (via drill 0.35)
  Top 0.152: v91.75,11.45 90.15,11.45 78.36,23.24 78.36,38.44 v78.05,38.75
  Bottom 0.152: R2.2 75.41,41.39 v78.05,38.75 | v91.75,11.45 97.26,11.45 U$1.3
E1  (via drill 0.35)
  Top 0.152: v104.77,74.25 104.77,68.53 106.71,66.59 106.71,51.31 116.56,41.46 116.56,26.27 116.35,26.06 v116.35,24.05
  Bottom 0.152: R7.2 C10.2 | C10.2 298.18,75.74 297.03,74.59 294.21,74.59 293.9,74.9 293.9,75.82 274.59,75.82 274.34,76.08 106.59,76.08 v104.77,74.25 | U1.E1 302.13,82.88 305.13,79.88 305.13,75.43 304.67,74.97 299.77,74.97 299,75.74 C10.2 | v116.35,24.05 113.62,21.32 106.55,21.32 106.25,21.02 106.25,19.66 U$1.21
GND  (via drill 0.35)
  Top 0.152: U1.D1 299.63,92.22 U1.C1 | v105.35,75.75 105.38,75.72 105.38,68.36 107.01,66.72 107.01,51.44 117.18,41.27 117.18,24.02 113.41,20.25 v111.35,20.25
  Top 0.406: v79.65,41.15 79.67,41.12 79.67,23.13 88.95,13.85 v89.95,13.85 93.35,13.85 93.75,13.45 93.75,9.35 v95.55,7.55 97.48,5.62 108.92,5.62 v110.65,7.35 110.95,7.65 110.95,16.11 111.58,16.75 111.58,17.92 110.05,19.45 v108.65,19.45 103.25,19.45 v99.45,23.25 99.45,22.95 96.75,20.25 v94.95,20.25
  Bottom 0.152: J1.5 J1.6 27.72,53.59 J1.4 | C8.2 300.4,75.76 C10.1 299.55,76.58 299.55,80.14 U1.C1 299.22,80.22 297.65,78.65 297.65,76.6 296.77,75.72 | C9.1 296.77,75.72 | U$1.15 101.48,24.75 102.55,25.83 104.95,25.83 105.64,25.14 Y2.4 | v105.35,75.75 105.36,75.75 106.04,76.43 274.42,76.43 274.72,76.13 294.05,76.13 294.21,75.97 294.21,75.03 294.34,74.89 295.58,74.89 296.41,75.72 296.77,75.72 | S1.A2 S1.A1 89.33,23 89.33,20.53 90.51,19.34 97.8,19.34 98.64,18.5 100.86,18.5 101.41,19.05 101.47,19.05 | C7.2 103.88,23.27 Y2.2 104.29,23.86 104.68,23.86 105.4,24.58 Y2.4 | Y2.4 106.19,25.12 C6.2 | R1.1 113.23,9.05 111.63,9.05 111.33,9.36 106.88,9.36 106.27,8.75 | v111.35,20.25 108.45,20.25 107.85,19.65 107.85,17.83
  Bottom 0.305: C4.1 96.45,8.38 | U$1.35 106.27,8.75 105.57,9.45 100.65,9.45 99.87,8.67 U$1.43 99.87,11.83 98.65,13.05 | 110.24,19.2 C2.1 108.71,19.39 v108.65,19.45 | v99.45,23.25 99.59,23.39 C11.1 | v110.65,7.35 109.85,8.15 C3.1 | 101.47,19 102.63,17.85 107.05,17.85 107.07,17.83 107.85,17.83 U$1.23 | 101.47,19 101.47,19.05 U$1.15 | U$1.5 98.63,13.03 98.65,13.05 | 101.47,19 101.47,15.87 98.65,13.05
  Bottom 0.406: v89.95,13.85 C1.1 | C1.1 92.63,12.96 94.16,12.96 94.23,13.03 U$1.5 | C1.1 91.71,13.88 C12.1 | v79.65,41.15 76.84,43.96 32.44,43.96 27.72,48.68 J1.4 | v95.55,7.55 96.38,8.38 96.45,8.38
  pour Top: 101.87,4.62 116.16,4.62 120.92,9.38 120.92,21.29 116.16,26.05 89.96,26.05 85.2,21.29 85.2,9.38 89.96,4.62
  pour Bottom: 85.2,21.29 89.96,26.05 116.16,26.05 120.92,21.29 120.92,9.38 116.16,4.62 89.96,4.62 85.2,9.38
  pour Bottom: 25.75,58.25 30.45,58.25 32.05,56.65 32.05,48.15 30.45,46.55 30.35,46.45 21.95,46.45 20.45,47.95 20.45,56.65 22.05,58.25
N$1
  Bottom 0.152: 4.MX1 78.06,90.29 D5.A
N$2
  Bottom 0.152: 5.MX1 97.11,90.29 D6.A
N$3
  Bottom 0.152: 6.MX1 116.16,90.29 D7.A
N$4
  Bottom 0.152: 7.MX1 135.21,90.29 D8.A
N$5
  Bottom 0.152: 8.MX1 154.26,90.29 D9.A
N$6
  Bottom 0.152: 9.MX1 173.31,90.29 D10.A
N$7
  Bottom 0.152: 0.MX1 192.36,90.29 D11.A
N$8
  Bottom 0.152: -.MX1 211.41,90.29 D12.A
N$9
  Bottom 0.152: =.MX1 230.46,90.29 D13.A
N$10
  Bottom 0.152: BCKSPC.MX1 259.03,90.29 D14.A
N$11
  Bottom 0.152: TAB.MX1 6.62,71.24 D15.A
N$12
  Bottom 0.152: Q.MX1 30.43,71.24 D16.A
N$13
  Bottom 0.152: W.MX1 49.48,71.24 D17.A
N$14
  Bottom 0.152: E.MX1 68.53,71.24 D18.A
N$15
  Bottom 0.152: R.MX1 87.58,71.24 D19.A
N$16
  Bottom 0.152: T.MX1 106.63,71.24 D20.A
N$17
  Bottom 0.152: Y.MX1 125.68,71.24 D21.A
N$18
  Bottom 0.152: U.MX1 144.73,71.24 D22.A
N$19
  Bottom 0.152: I.MX1 163.78,71.24 D23.A
N$20
  Bottom 0.152: O.MX1 182.83,71.24 D24.A
N$21
  Bottom 0.152: P.MX1 201.88,71.24 D25.A
N$22
  Bottom 0.152: [.MX1 220.93,71.24 D26.A
N$23
  Bottom 0.152: ].MX1 239.98,71.24 D27.A
N$24
  Bottom 0.152: \.MX1 263.79,71.24 D28.A
N$25
  Bottom 0.152: DEL.MX1 292.37,66.47 D29.A
N$26
  Bottom 0.152: CAPS.MX1 4.24,52.19 D30.A
N$27
  Bottom 0.152: A.MX1 35.19,52.19 D31.A
N$28
  Bottom 0.152: S.MX1 54.24,52.19 D32.A
N$29
  Bottom 0.152: D.MX1 73.29,52.19 D33.A
N$30
  Bottom 0.152: F.MX1 92.34,52.19 D34.A
N$31
  Bottom 0.152: G.MX1 111.39,52.19 D35.A
N$32
  Bottom 0.152: H.MX1 130.44,52.19 D36.A
N$33
  Bottom 0.152: J.MX1 149.49,52.19 D37.A
N$34
  Bottom 0.152: K.MX1 168.54,52.19 D38.A
N$35
  Bottom 0.152: L.MX1 187.59,52.19 D39.A
N$36
  Bottom 0.152: SEMICOL.MX1 206.64,52.19 D40.A
N$37
  Bottom 0.152: '.MX1 225.69,52.19 D41.A
N$38
  Bottom 0.152: ENTER.MX1 256.65,52.19 D42.A
N$39
  Bottom 0.152: PAGEUP.MX1 292.37,47.42 D43.A
N$40
  Bottom 0.152: Z.MX1 44.72,33.14 D45.A
N$41
  Bottom 0.152: X.MX1 63.77,33.14 D46.A
N$42
  Bottom 0.152: C.MX1 82.82,33.14 D47.A
N$43
  Bottom 0.152: V.MX1 101.87,33.14 D48.A
N$44
  Bottom 0.152: ESC.MX1 1.86,90.29 D1.A
N$45
  Bottom 0.152: B.MX1 120.92,33.14 D49.A
N$46
  Bottom 0.152: N.MX1 139.97,33.14 D50.A
N$47
  Bottom 0.152: 1.MX1 20.91,90.29 D2.A
N$48
  Bottom 0.152: M.MX1 159.02,33.14 D51.A
N$49
  Bottom 0.152: ,.MX1 178.07,33.14 D52.A
N$50
  Bottom 0.152: ..MX1 197.12,33.14 D53.A
N$51
  Bottom 0.152: /.MX1 216.17,33.14 D54.A
N$52
  Bottom 0.152: RSHIFT.MX1 242.36,33.14 D55.A
N$53
  Bottom 0.152: 2.MX1 39.96,90.29 D3.A
N$54
  Bottom 0.152: 3.MX1 59.01,90.29 D4.A
N$55
  Bottom 0.152: UP.MX1 273.32,28.37 D56.A
N$56
  Bottom 0.152: SHIFT.MX1 13.76,33.14 D44.A
N$57
  Bottom 0.152: PAGEDN.MX1 292.37,28.37 D57.A
N$58
  Bottom 0.152: WIN.MX1 23.29,14.09 D58.A
N$59
  Bottom 0.152: ALT.MX1 47.1,14.09 D59.A
N$60
  Bottom 0.152: RALT.MX1 204.26,14.09 D66.A
N$61
  Bottom 0.152: FN.MX1 228.07,14.09 D67.A
N$62
  Bottom 0.152: LEFT.MX1 254.27,9.32 D69.A
N$63
  Bottom 0.152: DOWN.MX1 273.32,9.32 D70.A
N$64
  Bottom 0.152: RIGHT.MX1 292.37,9.32 D71.A
N$65
  Bottom 0.152: SPACE.MX1 125.68,14.09 D62.A
N$66
  Bottom 0.152: 99.95,19.71 U$1.13 99.92,19.67 99.92,20.12 99.32,20.71 98.36,20.71 96.91,22.15 93.63,22.15 R4.1 92.52,21.04 90.77,21.04 S1.B2 S1.B1
N$67
  Bottom 0.152: R1.2 108.89,9.82 U$1.33
N$68
  Bottom 0.152: J1.2 25.72,47.48 31.81,41.39 R2.1
N$69
  Bottom 0.152: J1.3 26.72,48.08 31.97,42.83 R3.1
N$70
  Bottom 0.152: C1.2 93.51,13.83 U$1.6
N$71
  Bottom 0.152: Y2.1 105.95,23.37 C6.1 105.97,22.62 104.25,22.62 103.05,21.41 103.05,19.66 U$1.17
N$72
  pour Top: 205.35,80.75 205.35,79.75 206.35,78.85 207.25,79.85 206.45,80.85
N$73
  Bottom 0.152: Y2.3 103.86,25.02 C7.1 102.27,24.1 U$1.16
N$74
  pour Top: 214.25,79.75 216.05,77.65 218.75,78.85 216.75,79.85
R0
  Bottom 0.152: D14.C D13.C D12.C D11.C D10.C D9.C D8.C D7.C D6.C D5.C D4.C D3.C D2.C D1.C 1.86,11.51 5.53,7.84 93.53,7.84 95.93,5.44 100.64,5.44 102.28,7.08 102.28,8.02 U$1.40
R1
  Bottom 0.152: D29.C 287.61,64.9 D28.C D27.C D26.C D25.C D24.C D23.C D22.C D21.C D20.C D19.C D18.C D17.C D16.C D15.C 2.16,60.44 2.16,11.64 5.63,8.16 93.8,8.16 96.22,5.74 100.14,5.74 101.47,7.07 U$1.41
R2  (via drill 0.35)
  Top 0.152: v19.55,45.85 33.45,45.85 v33.55,45.75
  Bottom 0.152: D43.C 287.61,45.85 D42.C D41.C D40.C D39.C D38.C D37.C D36.C D35.C D34.C D33.C D32.C D31.C 35.1,45.75 v33.55,45.75 | v19.55,45.85 D30.C 2.47,44.07 2.47,11.76 5.69,8.54 95.04,8.54 96.35,9.85 97.26,9.85 U$1.1
R3
  Bottom 0.152: D57.C D56.C 268.56,26.8 D55.C D54.C D53.C D52.C D51.C D50.C D49.C 120.91,26.79 101.88,26.79 D48.C 85.2,26.8 | D44.C D45.C D46.C D47.C 85.2,26.8 | 85.2,26.8 85.2,21.8 89.15,17.85 97.26,17.85 U$1.11
R4
  Bottom 0.152: D71.C D70.C D69.C 249.51,7.75 D67.C D66.C 203.46,6.95 126.48,6.95 D62.C 125.68,7 123.43,4.75 100.65,4.75 | D58.C 23.37,6.48 47.02,6.48 D59.C 47.16,6.5 74.43,6.5 74.8,6.87 76.55,6.87 78.67,4.75 100.65,4.75 | U$1.39 103.07,7.17 100.65,4.75
VCC  (via drill 0.35)
  Top 0.152: v106.35,77.45 105.95,77.05 105.95,76.01 105.96,76 105.96,68.21 107.32,66.85 107.32,51.56 117.58,41.3 117.58,23.99 v112.75,19.16 v112.75,19.15
  Top 0.305: v94.55,14.65 v94.55,10.65
  Top 0.406: v95.25,15.45 88.14,15.45 80.58,23.01 80.58,37.82 v80.55,37.85 | v95.25,15.45 95.25,10.05 v98.95,6.35 v107.45,6.35 110.25,9.15 110.25,16.45 v110.85,17.05 | v95.25,15.45 95.25,17.45 v99.45,21.65
  Bottom 0.152: 300.95,81.48 302.67,81.48 304.08,80.06 304.08,77.56 R5.2 | 300.95,81.48 296.69,81.48 294.96,79.74 R6.1 294.25,76.74 274.97,76.74 274.58,77.13 106.67,77.13 v106.35,77.45 | R7.1 300.95,78.02 300.95,81.48 | U$1.14 100.68,19.64 100.68,21.29 | 100.68,21.29 C11.2 | C2.2 111.76,18.16 v112.75,19.15 | 100.68,21.29 100.43,21.04 98.56,21.04 96.56,23.04 R4.2
  Bottom 0.203: C11.2
  Bottom 0.305: U$1.44 98.45,8.03 C4.2 98.35,6.35 v98.95,6.35 | U$1.34 107.7,8.03 C3.2 107.84,6.35 v107.45,6.35 | v99.45,21.65 C11.2 | U$1.24 109.59,17.03 110.71,18.16 C2.2 | 97.26,14.65 U$1.7 | v94.55,10.65 97.26,10.65 U$1.2
  Bottom 0.406: v80.55,37.85 76.15,37.85 73.65,40.35 31.23,40.35 24.72,46.86 J1.1 | v95.25,15.45 C12.2 94.26,14.65 v94.55,14.65 97.26,14.65 | C2.2 111.48,17.68 v110.85,17.05
(copper drawn outside any net)
  shapes: Top area x4052